# EAGLE schematic deepak_schPIC32 (EAGLE 7.5.0)
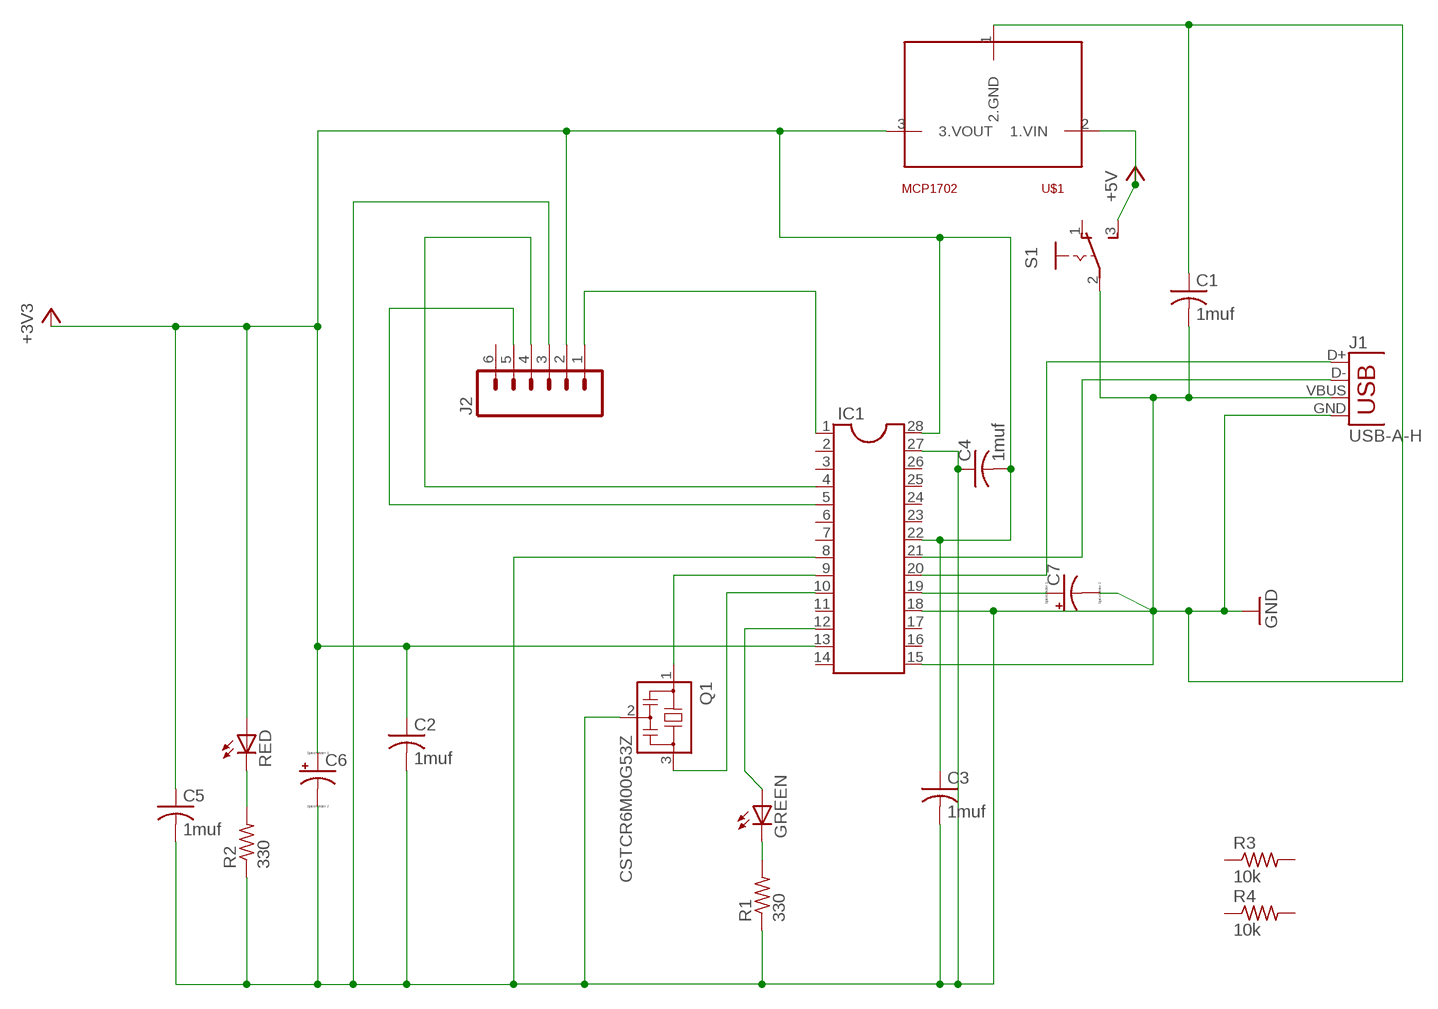
[diagram p0: schematic, sheet 1]

## Parts
C1  1muf  C-US025-025X050  [C025-025X050]
C2  1muf  C-US025-025X050  [C025-025X050]
C3  1muf  C-US025-025X050  [C025-025X050]
C4  1muf  C-US025-025X050  [C025-025X050]
C5  1muf  C-US025-025X050  [C025-025X050]
C6  CPOL-USE2-4  [E2-4]
C7  CPOL-USE2-4  [E2-4]
GREEN  LED3MM  [LED3MM]
IC1  DIL28-3  [DIL28-3]
J1  USB-A-H  [USB-A-H]
J2  M06SMD_MALE  [1X06_SMD_MALE]
Q1  CSTCR6M00G53Z  [CSTCR6M]
R1  330  R-US_0207/10  [0207/10]
R2  330  R-US_0207/10  [0207/10]
R3  10k  R-US_0207/10  [0207/10]
R4  10k  R-US_0207/10  [0207/10]
RED  LED3MM  [LED3MM]
S1  255SB  [255SB]
U$1  MCP1702  [TO92]

## Nets
+3V3: C2.1 C3.1 C4.2 C5.1 C6.+ IC1.13 IC1.22 IC1.28 J2.2 RED.A U$1.3(3.VOUT)
+5V: S1.3(S) U$1.2(1.VIN)
GND: C1.1 C2.2 C3.2 C4.1 C5.2 C6.- C7.- IC1.8 IC1.18 IC1.27 J1.GND J2.3 Q1.2 R1.1 R2.1 U$1.1(2.GND)
N$1: C1.2 IC1.15 J1.VBUS S1.2(P)
N$2: R2.2 RED.K(C)
N$3: IC1.1 J2.1
N$4: IC1.9 Q1.1
N$5: IC1.10 Q1.3
N$6: IC1.4 J2.4
N$7: IC1.5 J2.5
N$8: IC1.20 J1.D+
N$9: GREEN.A IC1.12
N$10: GREEN.K(C) R1.2
N$11: C7.+ IC1.19
N$12: IC1.21 J1.D-
Unconnected: IC1.2 IC1.3 IC1.6 IC1.7 IC1.11 IC1.14 IC1.16 IC1.17 IC1.23 IC1.24 IC1.25 IC1.26 J2.6 R3.1 R3.2 R4.1 R4.2 S1.1(O)

## Library data of the parts
C1-C5 = ME433:C-US: CAPACITOR, American symbol
C6 C7 = ME433:CPOL-US: POLARIZED CAPACITOR, American symbol
GREEN RED = ME433:LED: LED OSRAM: - CHIPLED LG R971, LG N971, LY N971, LG Q971, LY Q971, LO R971, LY R971 LH N974, LH R974 LS Q976, LO Q976, LY Q976 LO Q996 - Hyper CHIPLED LW Q18S LB Q993, LB Q99A, LB R99A - SideLED LS A670, LO A670, LY A670, LG A670, LP A670 LB A673, LV A673, LT A673, LW A673 LH A674 LY A675 LS A676, LA A676, LO A676, LY A676, LW A676 LS A679, LY A679, LG A679 - Hyper Micro SIDELED® LS Y876, LA Y876, LO Y876, LY Y876 LT Y87S - SmartLED LW L88C, LW L88S LB L89C, LB L89S, LG L890 LS L89K, LO L89K, LY L89K LS L896, LA L896, LO L896, LY L896 - TOPLED LS T670, LO T670, LY T670, LG T670, LP T670 LSG T670, LSP T670, LSY T670, LOP T670, LYG T670 LG T671, LOG T671, LSG T671 LB T673, LV T673, LT T673, LW T673 LH T674 LS T676, LA T676, LO T676, LY T676, LB T676, LH T676, LSB T676, LW T676 LB T67C, LV T67C, LT T67C, LS T67K, LO T67K, LY T67K, LW E67C LS E67B, LA E67B, LO E67B, LY E67B, LB E67C, LV E67C, LT E67C LW T67C LS T679, LY T679, LG T679 LS T770, LO T770, LY T770, LG T770, LP T770 LB T773, LV T773, LT T773, LW T773 LH T774 LS E675, LA E675, LY E675, LS T675 LS T776, LA T776, LO T776, LY T776, LB T776 LHGB T686 LT T68C, LB T68C - Hyper Mini TOPLED® LB M676 - Mini TOPLED Santana® LG M470 LS M47K, LO M47K, LY M47K Source: http://www.osram.convergy.de LUXEON: - LUMILED® LXK2-PW12-R00, LXK2-PW12-S00, LXK2-PW14-U00, LXK2-PW14-V00 LXK2-PM12-R00, LXK2-PM12-S00, LXK2-PM14-U00 LXK2-PE12-Q00, LXK2-PE12-R00, LXK2-PE12-S00, LXK2-PE14-T00, LXK2-PE14-U00 LXK2-PB12-K00, LXK2-PB12-L00, LXK2-PB12-M00, LXK2-PB14-N00, LXK2-PB14-P00, LXK2-PB14-Q00 LXK2-PR12-L00, LXK2-PR12-M00, LXK2-PR14-Q00, LXK2-PR14-R00 LXK2-PD12-Q00, LXK2-PD12-R00, LXK2-PD12-S00 LXK2-PH12-R00, LXK2-PH12-S00 LXK2-PL12-P00, LXK2-PL12-Q00, LXK2-PL12-R00 Source: www.luxeon.com KINGBRIGHT: KA-3528ASYC Source: www.kingbright.com
IC1 = ME433:DIL28: Dual In Line
J1 = ME433:USB: USB Connectors USB-B-PTH is fully proven SKU : PRT-00139/CONN-08278 USB-miniB is fully proven SKU : PRT-00587 USB-A-PCB is untested. USB-A-H is throughly reviewed, but untested. Spark Fun Electronics SKU : PRT-00437 USB-B-SMT is throughly reviewed, but untested. Needs silkscreen touching up. USB-A-S has not been used/tested USB-MB-H has not been used/tested USB-MICROB has been used. CONN-09505; PROD_ID: CONN-08367
J2 = ME433:M06: Header 6 Standard 6-pin 0.1" header. Use with straight break away headers (SKU : PRT-00116), right angle break away headers (PRT-00553), swiss pins (PRT-00743), machine pins (PRT-00117), and female headers (PRT-00115). Molex polarized connector foot print use with SKU : PRT-08094 with associated crimp pins and housings. NOTES ON THE VARIANTS LOCK and LOCK_LONGPADS... This footprint was designed to help hold the alignment of a through-hole component (i.e. 6-pin header) while soldering it into place. You may notice that each hole has been shifted either up or down by 0.005 of an inch from it's more standard position (which is a perfectly straight line). This slight alteration caused the pins (the squares in the middle) to touch the edges of the holes. Because they are alternating, it causes a "brace" to hold the component in place. 0.005 has proven to be the perfect amount of "off-center" position when using our standard breakaway headers. Although looks a little odd when you look at the bare footprint, once you have a header in there, the alteration is very hard to notice. Also,if you push a header all the way into place, it is covered up entirely on the bottom side. This idea of altering the position of holes to aid alignment will be further integrated into the Sparkfun Library for other footprints. It can help hold any component with 3 or more connection pins.; PROD_ID: CONN-11293
Q1 = murata-filter:CSTCR: Resonator Source: murata.co.jp; MPN: CSTCR6M00G53-R0; OC_FARNELL: 1170434; OC_NEWARK: 25M8759
R1-R4 = ME433:R-US_: RESISTOR, American symbol
S1 = switch:255SB: SLIDING SWITCH Distributor Buerklin, 11G810
U$1 = ME433:MCP1702